# Altium schematic sheet DigitalIO.SchDoc
size A4
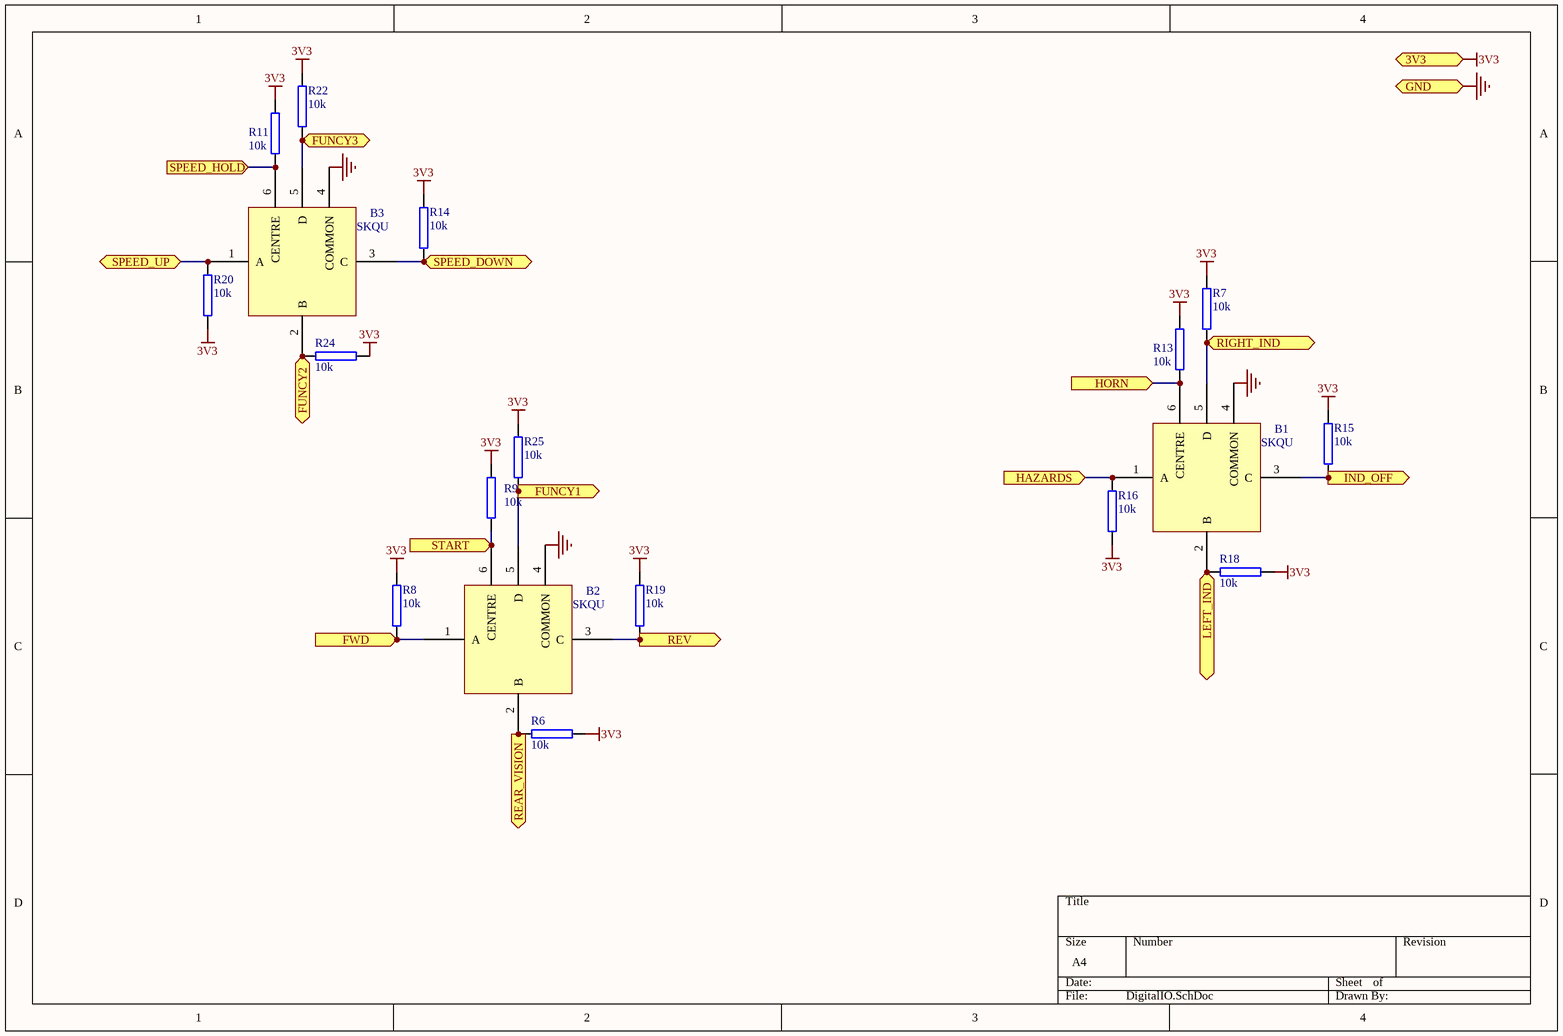
[diagram p0: DigitalIO.SchDoc]

## Parts
B1  SKQU  [SKQU]
B2  SKQU  [SKQU]
B3  SKQU  [SKQU]
R6  10k  [0603]
R7  10k  [0603]
R8  10k  [0603]
R9  10k  [0603]
R11  10k  [0603]
R13  10k  [0603]
R14  10k  [0603]
R15  10k  [0603]
R16  10k  [0603]
R18  10k  [0603]
R19  10k  [0603]
R20  10k  [0603]
R22  10k  [0603]
R24  10k  [0603]
R25  10k  [0603]

## Ports
3V3, FUNCY1, FUNCY2, FUNCY3, FWD, GND, HAZARDS, HORN, IND_OFF, LEFT_IND, REAR_VISION, REV, RIGHT_IND, SPEED_DOWN, SPEED_HOLD, SPEED_UP, START

## Nets
3V3: R6.1 R7.1 R8.2 R9.1 R11.1 R13.1 R14.1 R15.1 R16.1 R18.1 R19.1 R20.1 R22.1 R24.2 R25.1 ; port 3V3
GND: B1.4(COMMON) B2.4(COMMON) B3.4(COMMON) ; port GND
FUNCY1: B2.5(D) R25.2 ; port FUNCY1
FUNCY2: B3.2(B) R24.1 ; port FUNCY2
FUNCY3: B3.5(D) R22.2 ; port FUNCY3
FWD: B2.1(A) R8.1 ; port FWD
HAZARDS: B1.1(A) R16.2 ; port HAZARDS
HORN: B1.6(CENTRE) R13.2 ; port HORN
IND_OFF: B1.3(C) R15.2 ; port IND_OFF
LEFT_IND: B1.2(B) R18.2 ; port LEFT_IND
REAR_VISION: B2.2(B) R6.2 ; port REAR_VISION
REV: B2.3(C) R19.2 ; port REV
RIGHT_IND: B1.5(D) R7.2 ; port RIGHT_IND
SPEED_DOWN: B3.3(C) R14.2 ; port SPEED_DOWN
SPEED_HOLD: B3.6(CENTRE) R11.2 ; port SPEED_HOLD
SPEED_UP: B3.1(A) R20.2 ; port SPEED_UP
START: B2.6(CENTRE) R9.2 ; port START

## Library data of the parts
B1-B3 = SKQU: Multi-directional switch; Farnell: 1435776
R6-R9 R11 R13-R16 R18-R20 R22 R24 R25 = RES: Standard Resistor; Farnell: 612-601; Price: 0.11; Value: 10k